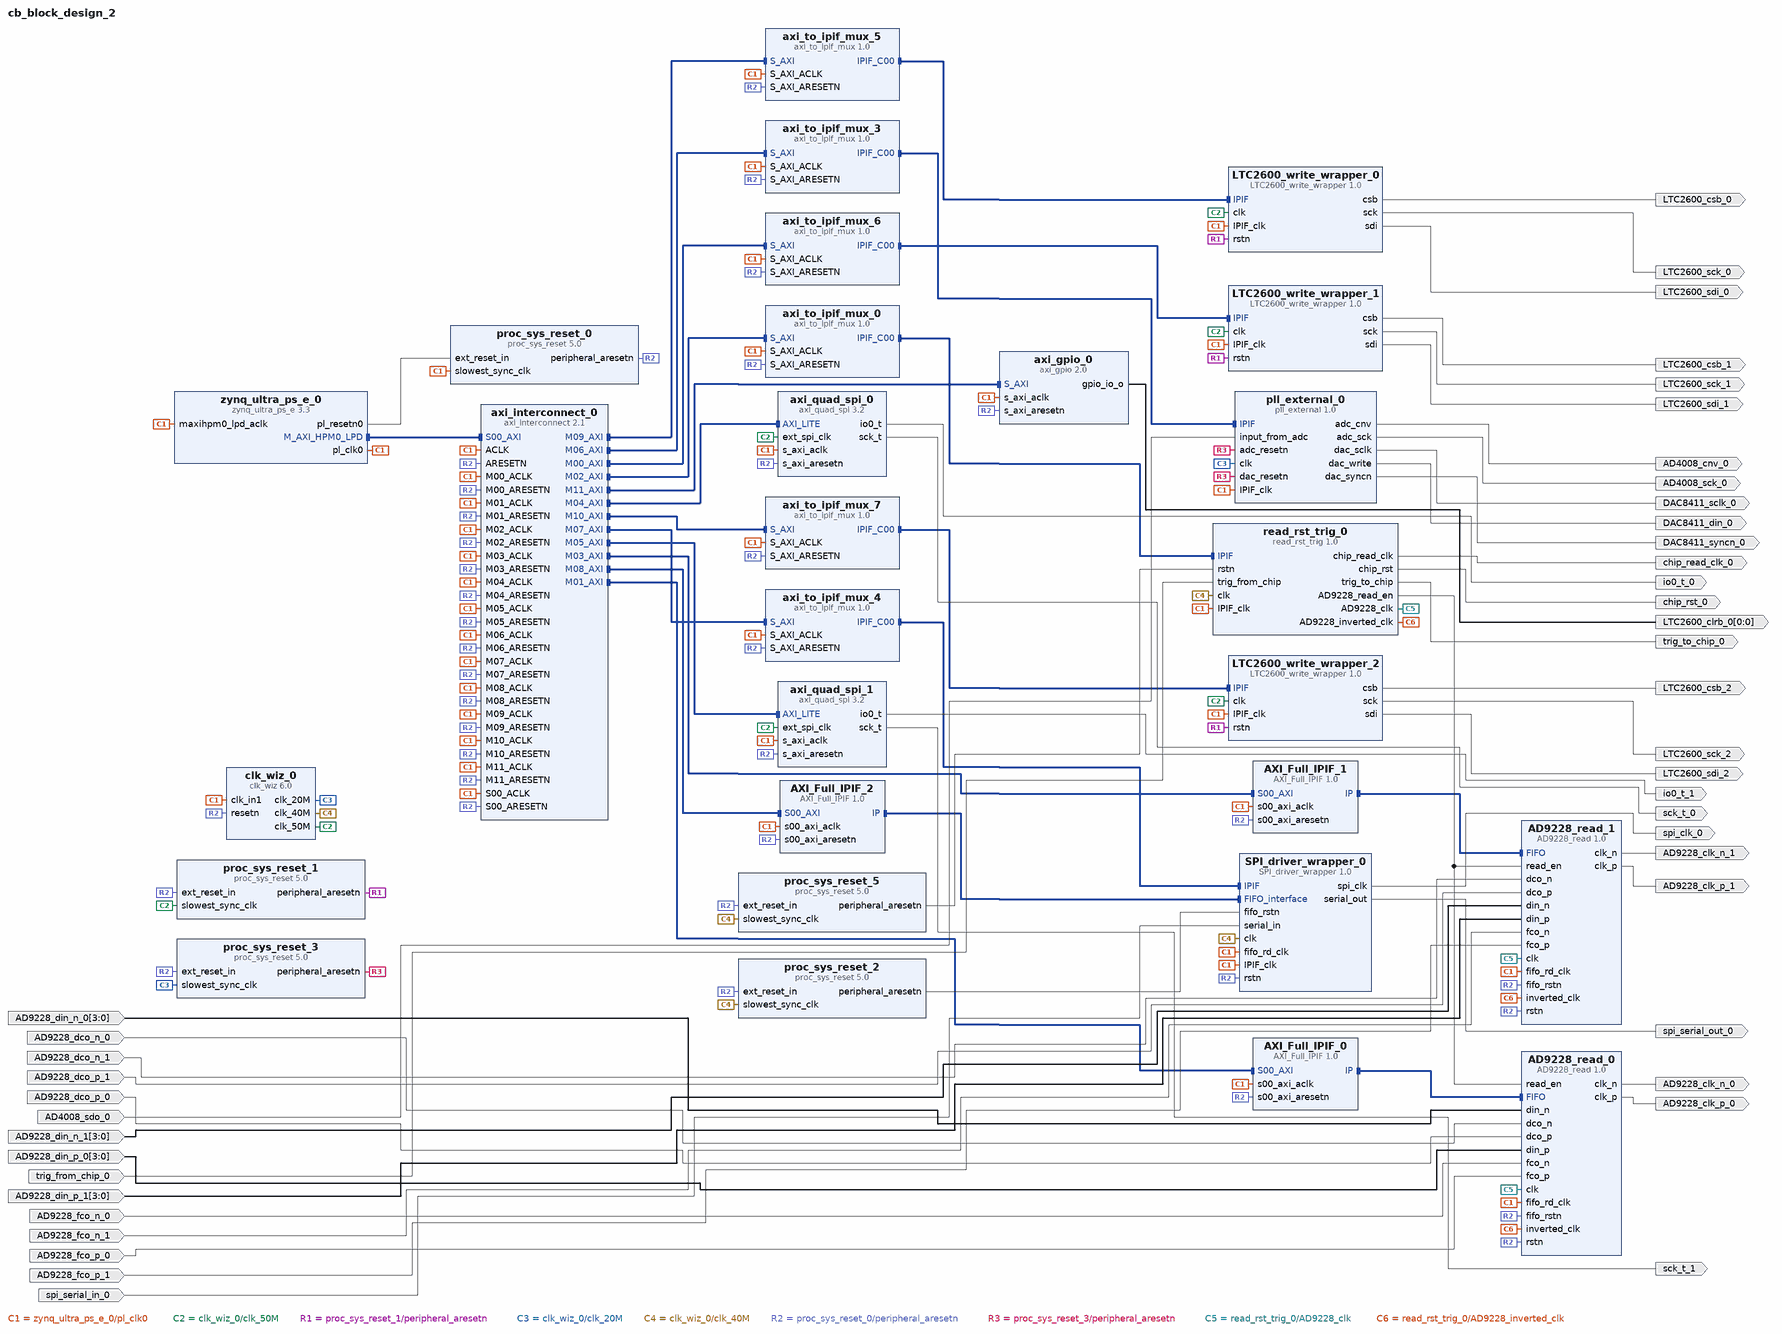
[diagram p0: block diagram of the top level]
# Vivado block design cb_block_design_2, xck26-sfvc784-2LV-c, Vivado 2021.2
create_bd_design cb_block_design_2

create_bd_port -dir I AD9228_dco_p_0
create_bd_port -dir I AD9228_fco_n_0
create_bd_port -dir I AD9228_fco_p_0
create_bd_port -dir I -from 3 -to 0 AD9228_din_n_0
create_bd_port -dir I -from 3 -to 0 AD9228_din_p_0
create_bd_port -dir I AD9228_dco_n_0
create_bd_port -dir O -type clk AD9228_clk_p_0
create_bd_port -dir O -type clk AD9228_clk_n_0
create_bd_port -dir I AD9228_dco_p_1
create_bd_port -dir I AD9228_fco_n_1
create_bd_port -dir I AD9228_fco_p_1
create_bd_port -dir I -from 3 -to 0 AD9228_din_n_1
create_bd_port -dir I AD9228_dco_n_1
create_bd_port -dir I -from 3 -to 0 AD9228_din_p_1
create_bd_port -dir I AD4008_sdo_0
create_bd_port -dir I spi_serial_in_0
create_bd_port -dir O -type clk spi_clk_0
create_bd_port -dir O spi_serial_out_0
create_bd_port -dir O AD4008_sck_0
create_bd_port -dir O DAC8411_din_0
create_bd_port -dir O DAC8411_sclk_0
create_bd_port -dir O DAC8411_syncn_0
create_bd_port -dir O AD4008_cnv_0
create_bd_port -dir O LTC2600_csb_0
create_bd_port -dir O LTC2600_sdi_0
create_bd_port -dir O LTC2600_sck_0
create_bd_port -dir O LTC2600_sdi_1
create_bd_port -dir O LTC2600_csb_1
create_bd_port -dir O LTC2600_sck_1
create_bd_port -dir O -type clk AD9228_clk_p_1
create_bd_port -dir O -type clk AD9228_clk_n_1
create_bd_port -dir I trig_from_chip_0
create_bd_port -dir O -type rst chip_rst_0
create_bd_port -dir O trig_to_chip_0
create_bd_port -dir O -type clk chip_read_clk_0
create_bd_port -dir O LTC2600_sck_2
create_bd_port -dir O LTC2600_csb_2
create_bd_port -dir O LTC2600_sdi_2
create_bd_port -dir O io0_t_0
create_bd_port -dir O sck_t_0
create_bd_port -dir O sck_t_1
create_bd_port -dir O io0_t_1
create_bd_port -dir O -from 0 -to 0 LTC2600_clrb_0

create_bd_cell -type ip -vlnv xilinx.com:ip:zynq_ultra_ps_e:3.3 zynq_ultra_ps_e_0
set_property -dict {CONFIG.PSU__DDR_HIGH_ADDRESS_GUI_ENABLE 0} [get_bd_cells zynq_ultra_ps_e_0]
# 2 more settings of zynq_ultra_ps_e_0 are not shown: defaults, MIO pin electricals, DDR timing, and values the tool derives
create_bd_cell -type ip -vlnv xilinx.com:ip:proc_sys_reset:5.0 proc_sys_reset_0
create_bd_cell -type ip -vlnv xilinx.com:ip:axi_interconnect:2.1 axi_interconnect_0
set_property -dict {CONFIG.NUM_MI 12 CONFIG.NUM_SI 1} [get_bd_cells axi_interconnect_0]
create_bd_cell -type ip -vlnv user.org:user:axi_to_ipif_mux:1.0 axi_to_ipif_mux_3
set_property -dict {CONFIG.N_CHIP 1} [get_bd_cells axi_to_ipif_mux_3]
create_bd_cell -type ip -vlnv user.org:user:axi_to_ipif_mux:1.0 axi_to_ipif_mux_4
set_property -dict {CONFIG.N_CHIP 1} [get_bd_cells axi_to_ipif_mux_4]
create_bd_cell -type ip -vlnv user.org:user:axi_to_ipif_mux:1.0 axi_to_ipif_mux_5
set_property -dict {CONFIG.N_CHIP 1} [get_bd_cells axi_to_ipif_mux_5]
create_bd_cell -type ip -vlnv user.org:user:axi_to_ipif_mux:1.0 axi_to_ipif_mux_6
set_property -dict {CONFIG.N_CHIP 1} [get_bd_cells axi_to_ipif_mux_6]
create_bd_cell -type ip -vlnv xilinx.com:ip:clk_wiz:6.0 clk_wiz_0
set_property -dict [list \
  CONFIG.CLKOUT1_JITTER 162.635 \
  CONFIG.CLKOUT1_PHASE_ERROR 87.180 \
  CONFIG.CLKOUT1_REQUESTED_OUT_FREQ 20 \
  CONFIG.CLKOUT2_JITTER 139.241 \
  CONFIG.CLKOUT2_PHASE_ERROR 87.180 \
  CONFIG.CLKOUT2_REQUESTED_OUT_FREQ 40 \
  CONFIG.CLKOUT2_USED true \
  CONFIG.CLKOUT3_JITTER 132.842 \
  CONFIG.CLKOUT3_PHASE_ERROR 87.180 \
  CONFIG.CLKOUT3_REQUESTED_OUT_FREQ 50 \
  CONFIG.CLKOUT3_USED true \
  CONFIG.CLKOUT4_JITTER 102.199 \
  CONFIG.CLKOUT4_PHASE_ERROR 87.180 \
  CONFIG.CLKOUT4_REQUESTED_OUT_FREQ 100.000 \
  CONFIG.CLKOUT4_USED false \
  CONFIG.CLKOUT5_JITTER 83.349 \
  CONFIG.CLKOUT5_PHASE_ERROR 78.394 \
  CONFIG.CLKOUT5_REQUESTED_OUT_FREQ 100.000 \
  CONFIG.CLKOUT5_USED false \
  CONFIG.CLK_OUT1_PORT clk_20M \
  CONFIG.CLK_OUT2_PORT clk_40M \
  CONFIG.CLK_OUT3_PORT clk_50M \
  CONFIG.CLK_OUT4_PORT clk_out4 \
  CONFIG.CLK_OUT5_PORT clk_out5 \
  CONFIG.MMCM_CLKFBOUT_MULT_F 12.375 \
  CONFIG.MMCM_CLKIN2_PERIOD 10.000 \
  CONFIG.MMCM_CLKOUT0_DIVIDE_F 60.000 \
  CONFIG.MMCM_CLKOUT1_DIVIDE 30 \
  CONFIG.MMCM_CLKOUT2_DIVIDE 24 \
  CONFIG.MMCM_CLKOUT3_DIVIDE 1 \
  CONFIG.MMCM_CLKOUT4_DIVIDE 1 \
  CONFIG.MMCM_DIVCLK_DIVIDE 1 \
  CONFIG.NUM_OUT_CLKS 3 \
  CONFIG.RESET_PORT resetn \
  CONFIG.RESET_TYPE ACTIVE_LOW \
  CONFIG.USE_LOCKED false \
] [get_bd_cells clk_wiz_0]
create_bd_cell -type ip -vlnv user.org:user:AXI_Full_IPIF:1.0 AXI_Full_IPIF_0
create_bd_cell -type ip -vlnv user.org:user:AXI_Full_IPIF:1.0 AXI_Full_IPIF_1
create_bd_cell -type ip -vlnv user.org:user:AXI_Full_IPIF:1.0 AXI_Full_IPIF_2
create_bd_cell -type ip -vlnv xilinx.com:ip:axi_quad_spi:3.2 axi_quad_spi_0
set_property -dict {CONFIG.C_NUM_TRANSFER_BITS 32 CONFIG.C_SCK_RATIO 2} [get_bd_cells axi_quad_spi_0]
create_bd_cell -type ip -vlnv xilinx.com:ip:axi_quad_spi:3.2 axi_quad_spi_1
set_property -dict {CONFIG.C_NUM_TRANSFER_BITS 32 CONFIG.C_SCK_RATIO 2} [get_bd_cells axi_quad_spi_1]
create_bd_cell -type ip -vlnv user.org:user:axi_to_ipif_mux:1.0 axi_to_ipif_mux_0
set_property -dict {CONFIG.N_CHIP 1} [get_bd_cells axi_to_ipif_mux_0]
create_bd_cell -type ip -vlnv user.org:user:axi_to_ipif_mux:1.0 axi_to_ipif_mux_7
set_property -dict {CONFIG.N_CHIP 1} [get_bd_cells axi_to_ipif_mux_7]
create_bd_cell -type ip -vlnv xilinx.com:user:LTC2600_write_wrapper:1.0 LTC2600_write_wrapper_0
create_bd_cell -type ip -vlnv xilinx.com:user:LTC2600_write_wrapper:1.0 LTC2600_write_wrapper_1
create_bd_cell -type ip -vlnv xilinx.com:user:LTC2600_write_wrapper:1.0 LTC2600_write_wrapper_2
create_bd_cell -type ip -vlnv xilinx.com:ip:axi_gpio:2.0 axi_gpio_0
set_property -dict {CONFIG.C_ALL_OUTPUTS 1 CONFIG.C_DOUT_DEFAULT 0xFFFFFFFF CONFIG.C_GPIO_WIDTH 1} [get_bd_cells axi_gpio_0]
create_bd_cell -type ip -vlnv xilinx.com:ip:proc_sys_reset:5.0 proc_sys_reset_1
create_bd_cell -type ip -vlnv xilinx.com:ip:proc_sys_reset:5.0 proc_sys_reset_2
create_bd_cell -type ip -vlnv xilinx.com:ip:proc_sys_reset:5.0 proc_sys_reset_3
create_bd_cell -type ip -vlnv xilinx.com:ip:proc_sys_reset:5.0 proc_sys_reset_5
create_bd_cell -type ip -vlnv xilinx.com:user:read_rst_trig:1.0 read_rst_trig_0
set_property -dict {CONFIG.AD9228_CLK_PHASE 28.8 CONFIG.CLK_PERIOD 25.0} [get_bd_cells read_rst_trig_0]
create_bd_cell -type ip -vlnv xilinx.com:user:pll_external:1.0 pll_external_0
create_bd_cell -type ip -vlnv xilinx.com:user:SPI_driver_wrapper:1.0 SPI_driver_wrapper_0
create_bd_cell -type ip -vlnv xilinx.com:user:AD9228_read:1.0 AD9228_read_0
set_property -dict [list \
  CONFIG.DCO_INVERTED 1 \
  CONFIG.DIN_INVERTED 1 \
  CONFIG.FCO_INVERTED 1 \
  CONFIG.SAMPLING_CLK_INVERTED 1 \
] [get_bd_cells AD9228_read_0]
create_bd_cell -type ip -vlnv xilinx.com:user:AD9228_read:1.0 AD9228_read_1

# ---- connections ----

connect_bd_intf_net [get_bd_intf_pins AXI_Full_IPIF_0/IP] [get_bd_intf_pins AD9228_read_0/FIFO]
connect_bd_intf_net [get_bd_intf_pins AXI_Full_IPIF_1/IP] [get_bd_intf_pins AD9228_read_1/FIFO]
connect_bd_intf_net [get_bd_intf_pins AXI_Full_IPIF_2/IP] [get_bd_intf_pins SPI_driver_wrapper_0/FIFO_interface]
connect_bd_intf_net [get_bd_intf_pins axi_to_ipif_mux_6/S_AXI] [get_bd_intf_pins axi_interconnect_0/M00_AXI]
connect_bd_intf_net [get_bd_intf_pins axi_interconnect_0/M01_AXI] [get_bd_intf_pins AXI_Full_IPIF_0/S00_AXI]
connect_bd_intf_net [get_bd_intf_pins axi_to_ipif_mux_0/S_AXI] [get_bd_intf_pins axi_interconnect_0/M02_AXI]
connect_bd_intf_net [get_bd_intf_pins axi_interconnect_0/M03_AXI] [get_bd_intf_pins AXI_Full_IPIF_1/S00_AXI]
connect_bd_intf_net [get_bd_intf_pins axi_interconnect_0/M04_AXI] [get_bd_intf_pins axi_quad_spi_0/AXI_LITE]
connect_bd_intf_net [get_bd_intf_pins axi_interconnect_0/M05_AXI] [get_bd_intf_pins axi_quad_spi_1/AXI_LITE]
connect_bd_intf_net [get_bd_intf_pins axi_interconnect_0/M06_AXI] [get_bd_intf_pins axi_to_ipif_mux_3/S_AXI]
connect_bd_intf_net [get_bd_intf_pins axi_interconnect_0/M07_AXI] [get_bd_intf_pins axi_to_ipif_mux_4/S_AXI]
connect_bd_intf_net [get_bd_intf_pins axi_interconnect_0/M08_AXI] [get_bd_intf_pins AXI_Full_IPIF_2/S00_AXI]
connect_bd_intf_net [get_bd_intf_pins axi_interconnect_0/M09_AXI] [get_bd_intf_pins axi_to_ipif_mux_5/S_AXI]
connect_bd_intf_net [get_bd_intf_pins axi_interconnect_0/M10_AXI] [get_bd_intf_pins axi_to_ipif_mux_7/S_AXI]
connect_bd_intf_net [get_bd_intf_pins axi_interconnect_0/M11_AXI] [get_bd_intf_pins axi_gpio_0/S_AXI]
connect_bd_intf_net [get_bd_intf_pins axi_to_ipif_mux_0/IPIF_C00] [get_bd_intf_pins read_rst_trig_0/IPIF]
connect_bd_intf_net [get_bd_intf_pins axi_to_ipif_mux_3/IPIF_C00] [get_bd_intf_pins pll_external_0/IPIF]
connect_bd_intf_net [get_bd_intf_pins axi_to_ipif_mux_4/IPIF_C00] [get_bd_intf_pins SPI_driver_wrapper_0/IPIF]
connect_bd_intf_net [get_bd_intf_pins axi_to_ipif_mux_5/IPIF_C00] [get_bd_intf_pins LTC2600_write_wrapper_0/IPIF]
connect_bd_intf_net [get_bd_intf_pins axi_to_ipif_mux_6/IPIF_C00] [get_bd_intf_pins LTC2600_write_wrapper_1/IPIF]
connect_bd_intf_net [get_bd_intf_pins axi_to_ipif_mux_7/IPIF_C00] [get_bd_intf_pins LTC2600_write_wrapper_2/IPIF]
connect_bd_intf_net [get_bd_intf_pins zynq_ultra_ps_e_0/M_AXI_HPM0_LPD] [get_bd_intf_pins axi_interconnect_0/S00_AXI]
connect_bd_net -net ACLK_1 [get_bd_pins zynq_ultra_ps_e_0/pl_clk0] \
  [get_bd_pins zynq_ultra_ps_e_0/maxihpm0_lpd_aclk] [get_bd_pins axi_interconnect_0/ACLK] \
  [get_bd_pins axi_interconnect_0/S00_ACLK] [get_bd_pins axi_interconnect_0/M00_ACLK] \
  [get_bd_pins axi_interconnect_0/M01_ACLK] [get_bd_pins axi_interconnect_0/M02_ACLK] \
  [get_bd_pins axi_interconnect_0/M03_ACLK] [get_bd_pins axi_interconnect_0/M04_ACLK] \
  [get_bd_pins axi_interconnect_0/M05_ACLK] [get_bd_pins axi_interconnect_0/M06_ACLK] \
  [get_bd_pins axi_interconnect_0/M07_ACLK] [get_bd_pins axi_interconnect_0/M08_ACLK] \
  [get_bd_pins axi_interconnect_0/M09_ACLK] [get_bd_pins proc_sys_reset_0/slowest_sync_clk] [get_bd_pins clk_wiz_0/clk_in1] \
  [get_bd_pins AXI_Full_IPIF_0/s00_axi_aclk] [get_bd_pins AXI_Full_IPIF_1/s00_axi_aclk] \
  [get_bd_pins axi_to_ipif_mux_3/S_AXI_ACLK] [get_bd_pins axi_to_ipif_mux_4/S_AXI_ACLK] \
  [get_bd_pins AXI_Full_IPIF_2/s00_axi_aclk] [get_bd_pins axi_to_ipif_mux_5/S_AXI_ACLK] \
  [get_bd_pins axi_to_ipif_mux_6/S_AXI_ACLK] [get_bd_pins axi_quad_spi_1/s_axi_aclk] [get_bd_pins axi_quad_spi_0/s_axi_aclk] \
  [get_bd_pins axi_to_ipif_mux_0/S_AXI_ACLK] [get_bd_pins LTC2600_write_wrapper_0/IPIF_clk] \
  [get_bd_pins LTC2600_write_wrapper_1/IPIF_clk] [get_bd_pins LTC2600_write_wrapper_2/IPIF_clk] \
  [get_bd_pins axi_gpio_0/s_axi_aclk] [get_bd_pins axi_interconnect_0/M10_ACLK] [get_bd_pins axi_interconnect_0/M11_ACLK] \
  [get_bd_pins axi_to_ipif_mux_7/S_AXI_ACLK] [get_bd_pins read_rst_trig_0/IPIF_clk] [get_bd_pins pll_external_0/IPIF_clk] \
  [get_bd_pins SPI_driver_wrapper_0/IPIF_clk] [get_bd_pins SPI_driver_wrapper_0/fifo_rd_clk] \
  [get_bd_pins AD9228_read_0/fifo_rd_clk] [get_bd_pins AD9228_read_1/fifo_rd_clk]
connect_bd_net -net AD9228_din_n_0_1 [get_bd_ports AD9228_din_n_0] [get_bd_pins AD9228_read_0/din_n]
connect_bd_net [get_bd_pins AD9228_read_0/clk_n] [get_bd_ports AD9228_clk_n_0]
connect_bd_net [get_bd_pins AD9228_read_0/clk_p] [get_bd_ports AD9228_clk_p_0]
connect_bd_net [get_bd_pins AD9228_read_1/clk_n] [get_bd_ports AD9228_clk_n_1]
connect_bd_net [get_bd_pins AD9228_read_1/clk_p] [get_bd_ports AD9228_clk_p_1]
connect_bd_net [get_bd_pins LTC2600_write_wrapper_0/csb] [get_bd_ports LTC2600_csb_0]
connect_bd_net [get_bd_pins LTC2600_write_wrapper_0/sck] [get_bd_ports LTC2600_sck_0]
connect_bd_net [get_bd_pins LTC2600_write_wrapper_0/sdi] [get_bd_ports LTC2600_sdi_0]
connect_bd_net [get_bd_pins LTC2600_write_wrapper_1/csb] [get_bd_ports LTC2600_csb_1]
connect_bd_net [get_bd_pins LTC2600_write_wrapper_1/sck] [get_bd_ports LTC2600_sck_1]
connect_bd_net [get_bd_pins LTC2600_write_wrapper_1/sdi] [get_bd_ports LTC2600_sdi_1]
connect_bd_net [get_bd_pins LTC2600_write_wrapper_2/csb] [get_bd_ports LTC2600_csb_2]
connect_bd_net [get_bd_pins LTC2600_write_wrapper_2/sck] [get_bd_ports LTC2600_sck_2]
connect_bd_net [get_bd_pins LTC2600_write_wrapper_2/sdi] [get_bd_ports LTC2600_sdi_2]
connect_bd_net [get_bd_pins clk_wiz_0/clk_50M] \
  [get_bd_pins axi_quad_spi_1/ext_spi_clk] [get_bd_pins axi_quad_spi_0/ext_spi_clk] [get_bd_pins LTC2600_write_wrapper_0/clk] \
  [get_bd_pins LTC2600_write_wrapper_1/clk] [get_bd_pins LTC2600_write_wrapper_2/clk] \
  [get_bd_pins proc_sys_reset_1/slowest_sync_clk]
connect_bd_net [get_bd_pins proc_sys_reset_1/peripheral_aresetn] \
  [get_bd_pins LTC2600_write_wrapper_1/rstn] [get_bd_pins LTC2600_write_wrapper_0/rstn] \
  [get_bd_pins LTC2600_write_wrapper_2/rstn]
connect_bd_net [get_bd_pins SPI_driver_wrapper_0/serial_out] [get_bd_ports spi_serial_out_0]
connect_bd_net [get_bd_pins SPI_driver_wrapper_0/spi_clk] [get_bd_ports spi_clk_0]
connect_bd_net [get_bd_pins axi_gpio_0/gpio_io_o] [get_bd_ports LTC2600_clrb_0]
connect_bd_net [get_bd_pins axi_quad_spi_0/io0_t] [get_bd_ports io0_t_0]
connect_bd_net [get_bd_pins axi_quad_spi_0/sck_t] [get_bd_ports sck_t_0]
connect_bd_net [get_bd_pins axi_quad_spi_1/io0_t] [get_bd_ports io0_t_1]
connect_bd_net [get_bd_pins axi_quad_spi_1/sck_t] [get_bd_ports sck_t_1]
connect_bd_net [get_bd_pins clk_wiz_0/clk_20M] [get_bd_pins proc_sys_reset_3/slowest_sync_clk] [get_bd_pins pll_external_0/clk]
connect_bd_net [get_bd_pins clk_wiz_0/clk_40M] \
  [get_bd_pins proc_sys_reset_2/slowest_sync_clk] [get_bd_pins proc_sys_reset_5/slowest_sync_clk] \
  [get_bd_pins read_rst_trig_0/clk] [get_bd_pins SPI_driver_wrapper_0/clk]
connect_bd_net -net dco_n_0_1 [get_bd_ports AD9228_dco_n_0] [get_bd_pins AD9228_read_0/dco_n]
connect_bd_net -net dco_n_1_1 [get_bd_ports AD9228_dco_n_1] [get_bd_pins AD9228_read_1/dco_n]
connect_bd_net -net dco_p_0_1 [get_bd_ports AD9228_dco_p_0] [get_bd_pins AD9228_read_0/dco_p]
connect_bd_net -net dco_p_1_1 [get_bd_ports AD9228_dco_p_1] [get_bd_pins AD9228_read_1/dco_p]
connect_bd_net -net din_n_1_1 [get_bd_ports AD9228_din_n_1] [get_bd_pins AD9228_read_1/din_n]
connect_bd_net -net din_p_0_1 [get_bd_ports AD9228_din_p_0] [get_bd_pins AD9228_read_0/din_p]
connect_bd_net -net din_p_1_1 [get_bd_ports AD9228_din_p_1] [get_bd_pins AD9228_read_1/din_p]
connect_bd_net -net fco_n_0_1 [get_bd_ports AD9228_fco_n_0] [get_bd_pins AD9228_read_0/fco_n]
connect_bd_net -net fco_n_1_1 [get_bd_ports AD9228_fco_n_1] [get_bd_pins AD9228_read_1/fco_n]
connect_bd_net -net fco_p_0_1 [get_bd_ports AD9228_fco_p_0] [get_bd_pins AD9228_read_0/fco_p]
connect_bd_net -net fco_p_1_1 [get_bd_ports AD9228_fco_p_1] [get_bd_pins AD9228_read_1/fco_p]
connect_bd_net -net input_from_adc_0_1 [get_bd_ports AD4008_sdo_0] [get_bd_pins pll_external_0/input_from_adc]
connect_bd_net [get_bd_pins pll_external_0/adc_cnv] [get_bd_ports AD4008_cnv_0]
connect_bd_net [get_bd_pins pll_external_0/adc_sck] [get_bd_ports AD4008_sck_0]
connect_bd_net [get_bd_pins pll_external_0/dac_sclk] [get_bd_ports DAC8411_sclk_0]
connect_bd_net [get_bd_pins pll_external_0/dac_syncn] [get_bd_ports DAC8411_syncn_0]
connect_bd_net [get_bd_pins pll_external_0/dac_write] [get_bd_ports DAC8411_din_0]
connect_bd_net [get_bd_pins proc_sys_reset_0/peripheral_aresetn] \
  [get_bd_pins axi_interconnect_0/ARESETN] [get_bd_pins axi_interconnect_0/S00_ARESETN] \
  [get_bd_pins axi_interconnect_0/M00_ARESETN] [get_bd_pins axi_interconnect_0/M01_ARESETN] \
  [get_bd_pins axi_interconnect_0/M02_ARESETN] [get_bd_pins axi_interconnect_0/M03_ARESETN] \
  [get_bd_pins axi_interconnect_0/M04_ARESETN] [get_bd_pins axi_interconnect_0/M05_ARESETN] \
  [get_bd_pins axi_interconnect_0/M06_ARESETN] [get_bd_pins axi_interconnect_0/M07_ARESETN] \
  [get_bd_pins axi_interconnect_0/M08_ARESETN] [get_bd_pins axi_interconnect_0/M09_ARESETN] \
  [get_bd_pins AXI_Full_IPIF_0/s00_axi_aresetn] [get_bd_pins AXI_Full_IPIF_1/s00_axi_aresetn] \
  [get_bd_pins axi_to_ipif_mux_3/S_AXI_ARESETN] [get_bd_pins axi_to_ipif_mux_4/S_AXI_ARESETN] \
  [get_bd_pins AXI_Full_IPIF_2/s00_axi_aresetn] [get_bd_pins axi_to_ipif_mux_5/S_AXI_ARESETN] \
  [get_bd_pins axi_to_ipif_mux_6/S_AXI_ARESETN] [get_bd_pins axi_quad_spi_0/s_axi_aresetn] \
  [get_bd_pins axi_quad_spi_1/s_axi_aresetn] [get_bd_pins clk_wiz_0/resetn] [get_bd_pins axi_to_ipif_mux_0/S_AXI_ARESETN] \
  [get_bd_pins axi_gpio_0/s_axi_aresetn] [get_bd_pins axi_interconnect_0/M10_ARESETN] \
  [get_bd_pins axi_interconnect_0/M11_ARESETN] [get_bd_pins axi_to_ipif_mux_7/S_AXI_ARESETN] \
  [get_bd_pins proc_sys_reset_1/ext_reset_in] [get_bd_pins proc_sys_reset_2/ext_reset_in] \
  [get_bd_pins proc_sys_reset_3/ext_reset_in] [get_bd_pins proc_sys_reset_5/ext_reset_in] \
  [get_bd_pins SPI_driver_wrapper_0/rstn] [get_bd_pins AD9228_read_0/rstn] [get_bd_pins AD9228_read_0/fifo_rstn] \
  [get_bd_pins AD9228_read_1/rstn] [get_bd_pins AD9228_read_1/fifo_rstn]
connect_bd_net [get_bd_pins proc_sys_reset_2/peripheral_aresetn] [get_bd_pins SPI_driver_wrapper_0/fifo_rstn]
connect_bd_net [get_bd_pins proc_sys_reset_3/peripheral_aresetn] [get_bd_pins pll_external_0/adc_resetn] [get_bd_pins pll_external_0/dac_resetn]
connect_bd_net [get_bd_pins proc_sys_reset_5/peripheral_aresetn] [get_bd_pins read_rst_trig_0/rstn]
connect_bd_net [get_bd_pins read_rst_trig_0/AD9228_clk] [get_bd_pins AD9228_read_0/clk] [get_bd_pins AD9228_read_1/clk]
connect_bd_net [get_bd_pins read_rst_trig_0/AD9228_inverted_clk] [get_bd_pins AD9228_read_0/inverted_clk] [get_bd_pins AD9228_read_1/inverted_clk]
connect_bd_net [get_bd_pins read_rst_trig_0/AD9228_read_en] [get_bd_pins AD9228_read_0/read_en] [get_bd_pins AD9228_read_1/read_en]
connect_bd_net [get_bd_pins read_rst_trig_0/chip_read_clk] [get_bd_ports chip_read_clk_0]
connect_bd_net [get_bd_pins read_rst_trig_0/chip_rst] [get_bd_ports chip_rst_0]
connect_bd_net [get_bd_pins read_rst_trig_0/trig_to_chip] [get_bd_ports trig_to_chip_0]
connect_bd_net -net spi_serial_in_0_1 [get_bd_ports spi_serial_in_0] [get_bd_pins SPI_driver_wrapper_0/serial_in]
connect_bd_net -net trig_from_chip_0_1 [get_bd_ports trig_from_chip_0] [get_bd_pins read_rst_trig_0/trig_from_chip]
connect_bd_net [get_bd_pins zynq_ultra_ps_e_0/pl_resetn0] [get_bd_pins proc_sys_reset_0/ext_reset_in]

# ---- address map ----
assign_bd_address -offset 0x0080000000 -range 64K -target_address_space [get_bd_addr_spaces zynq_ultra_ps_e_0/Data] [get_bd_addr_segs AXI_Full_IPIF_0/S00_AXI/S00_AXI_mem]
assign_bd_address -offset 0x0080010000 -range 64K -target_address_space [get_bd_addr_spaces zynq_ultra_ps_e_0/Data] [get_bd_addr_segs AXI_Full_IPIF_1/S00_AXI/S00_AXI_mem]
assign_bd_address -offset 0x0080020000 -range 64K -target_address_space [get_bd_addr_spaces zynq_ultra_ps_e_0/Data] [get_bd_addr_segs AXI_Full_IPIF_2/S00_AXI/S00_AXI_mem]
assign_bd_address -offset 0x0080030000 -range 64K -target_address_space [get_bd_addr_spaces zynq_ultra_ps_e_0/Data] [get_bd_addr_segs axi_quad_spi_0/AXI_LITE/Reg]
assign_bd_address -offset 0x0080040000 -range 64K -target_address_space [get_bd_addr_spaces zynq_ultra_ps_e_0/Data] [get_bd_addr_segs axi_quad_spi_1/AXI_LITE/Reg]
assign_bd_address -offset 0x0080050000 -range 64K -target_address_space [get_bd_addr_spaces zynq_ultra_ps_e_0/Data] [get_bd_addr_segs axi_to_ipif_mux_0/S_AXI/reg0]
assign_bd_address -offset 0x0080060000 -range 64K -target_address_space [get_bd_addr_spaces zynq_ultra_ps_e_0/Data] [get_bd_addr_segs axi_to_ipif_mux_6/S_AXI/reg0]
assign_bd_address -offset 0x0080070000 -range 64K -target_address_space [get_bd_addr_spaces zynq_ultra_ps_e_0/Data] [get_bd_addr_segs axi_to_ipif_mux_3/S_AXI/reg0]
assign_bd_address -offset 0x0080080000 -range 64K -target_address_space [get_bd_addr_spaces zynq_ultra_ps_e_0/Data] [get_bd_addr_segs axi_to_ipif_mux_4/S_AXI/reg0]
assign_bd_address -offset 0x0080090000 -range 64K -target_address_space [get_bd_addr_spaces zynq_ultra_ps_e_0/Data] [get_bd_addr_segs axi_to_ipif_mux_5/S_AXI/reg0]
assign_bd_address -offset 0x00800A0000 -range 64K -target_address_space [get_bd_addr_spaces zynq_ultra_ps_e_0/Data] [get_bd_addr_segs axi_to_ipif_mux_7/S_AXI/reg0]
assign_bd_address -offset 0x00800B0000 -range 64K -target_address_space [get_bd_addr_spaces zynq_ultra_ps_e_0/Data] [get_bd_addr_segs axi_gpio_0/S_AXI/Reg]

validate_bd_design
save_bd_design
